# Altium project EE209_Prototype.PrjPcb
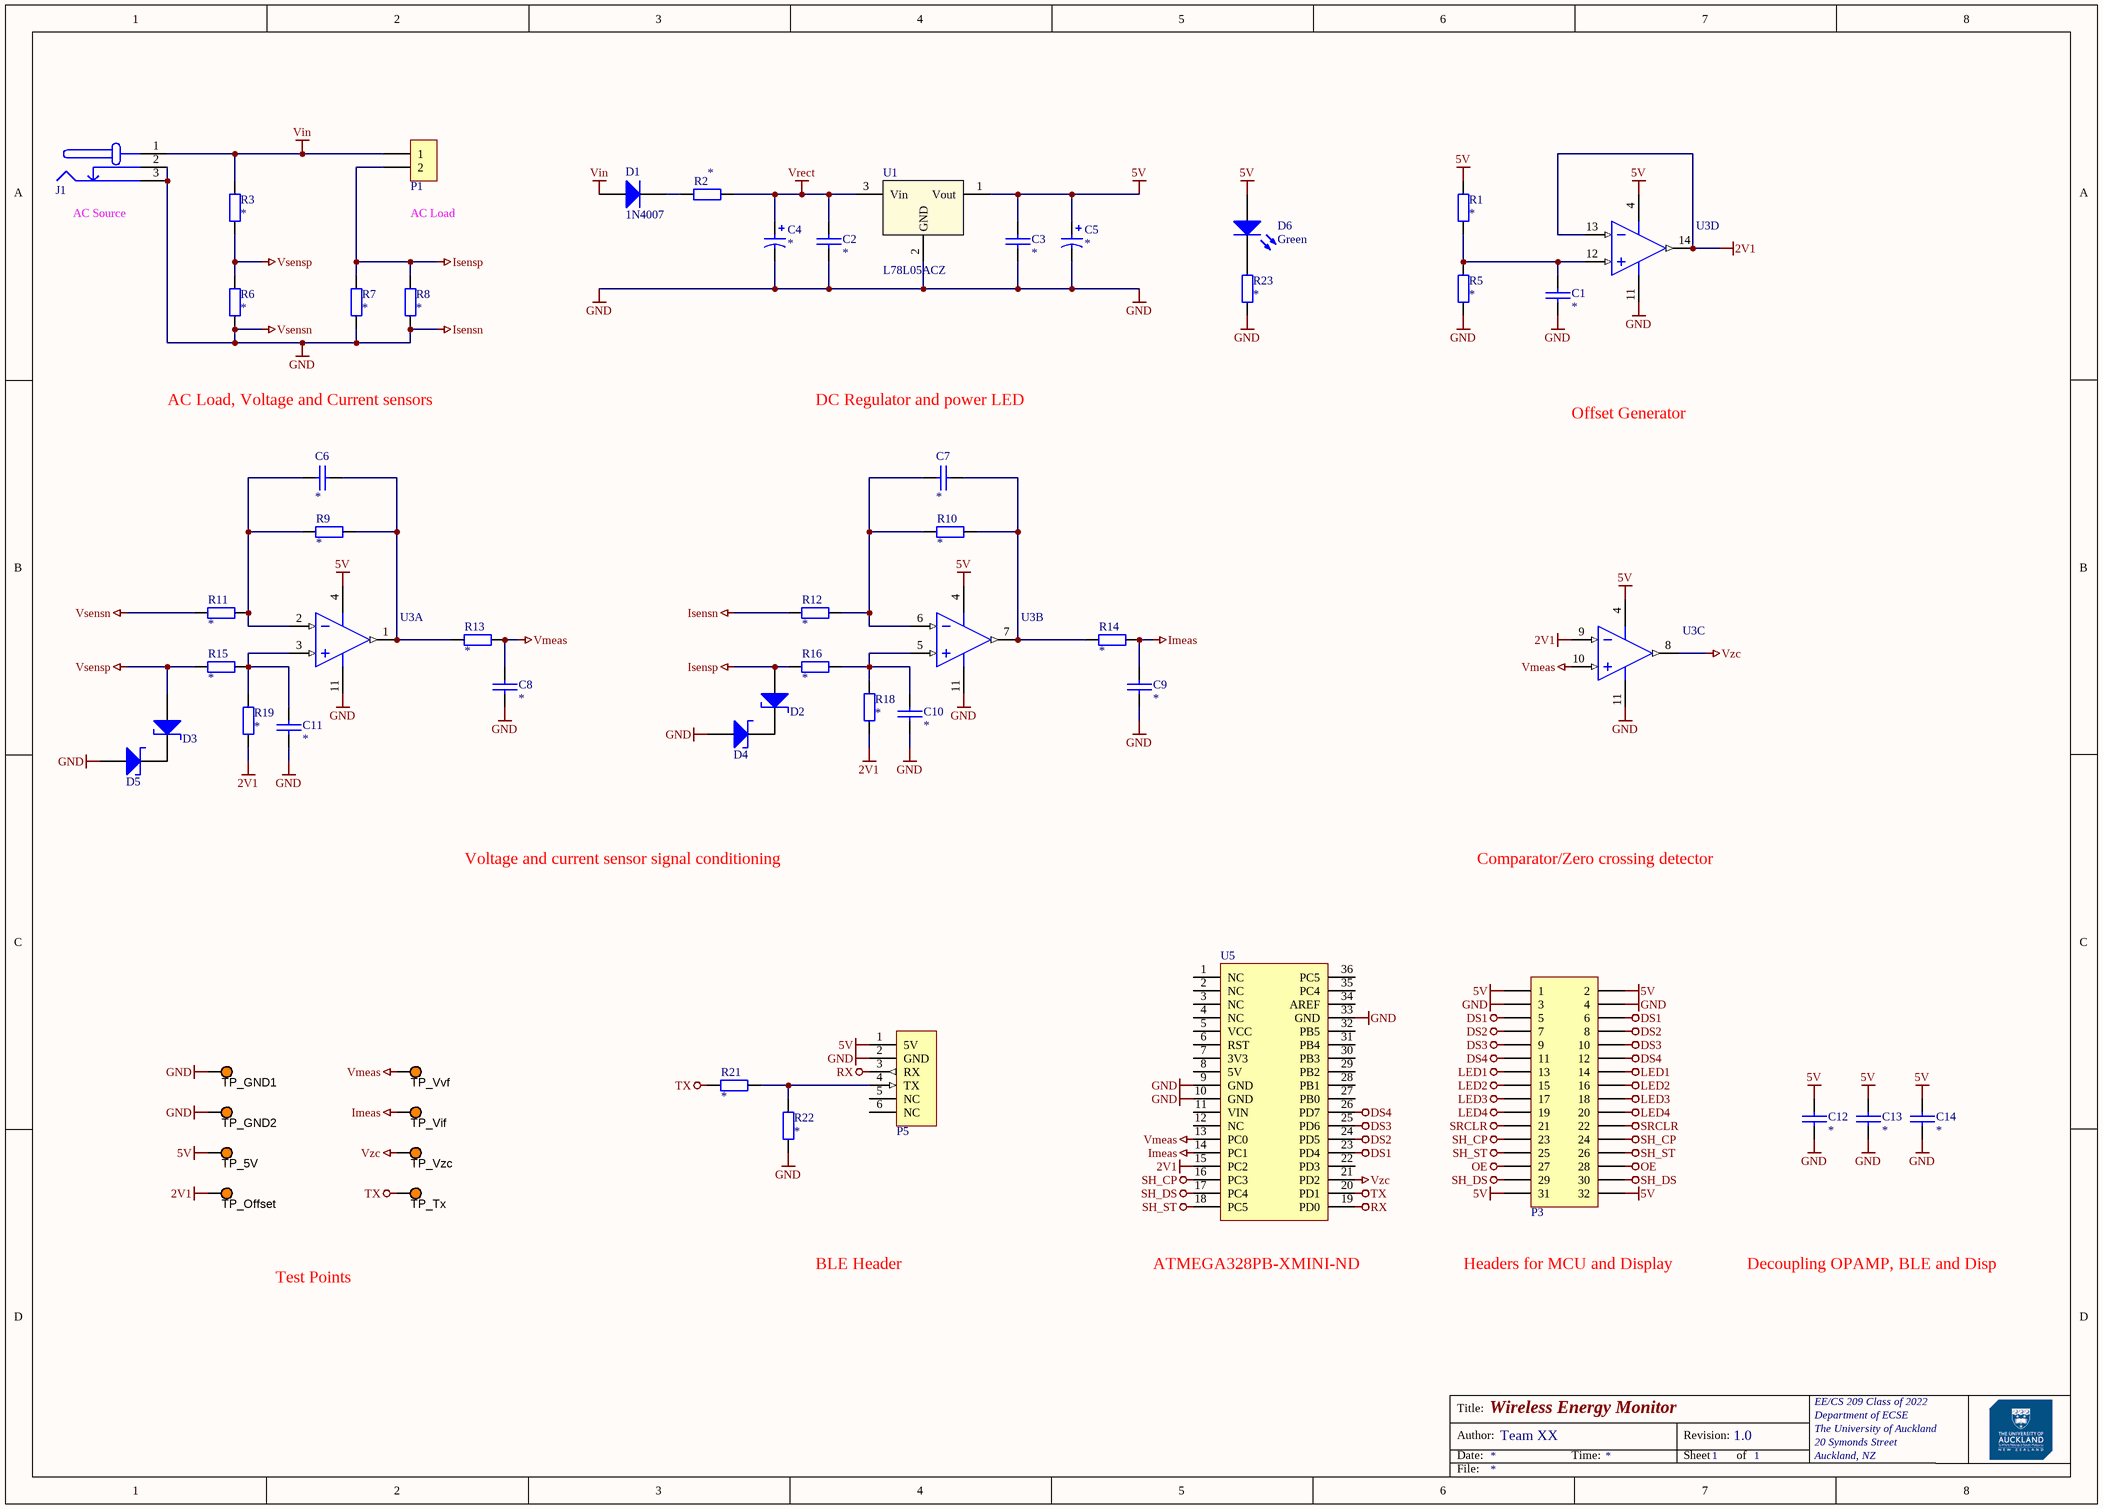
[diagram p0: EE209_Schematic.SchDoc]
1 sheet, 55 parts. Net scope: global (net labels, ports and power ports of the same name join across sheets).
Board file: PCB.PcbDoc

## Sheet EE209_Schematic.SchDoc: Wireless Energy Monitor
size A3; Author: Team XX; Organization: EE/CS 209 Class of 2022; Address1: Department of ECSE; Address2: The University of Auckland; Address3: 20 Symonds Street; Address4: Auckland, NZ; Revision: 1.0; SheetNumber: 1; SheetTotal: 1

### Parts
C1  *  [CCAP-5P0]
C2  *  [CCAP-5P0]
C3  *  [CCAP-5P0]
C4  *  [CAP-RAD-2.5mm Pitch]
C5  *  [CAP-RAD-2.5mm Pitch]
C6  *  [CCAP-5P0]
C7  *  [CCAP-5P0]
C8  *  [CCAP-5P0]
C9  *  [CCAP-5P0]
C10  *  [CCAP-5P0]
C11  *  [CCAP-5P0]
C12  *  [CCAP-5P0]
C13  *  [CCAP-5P0]
C14  *  [CCAP-5P0]
D1  1N4007  [1N4007-MFG]
D2  BZX79-CXVX  [AXIAL-Zener-0.4]  (value not drawn)
D3  BZX79-CXVX  [AXIAL-Zener-0.4]  (value not drawn)
D4  BZX79-CXVX  [AXIAL-Zener-0.4]  (value not drawn)
D5  BZX79-CXVX  [AXIAL-Zener-0.4]  (value not drawn)
D6  Green  [LED]
J1  DC barrel jack  [AC-Socket]  (value not drawn)
P1  Dual Banana Plugs  [Dual Banana Plug]  (value not drawn)
P3  Display  [Display]  (value not drawn)
P5  BLE Module Header  [HM10_HDR1X6]  (value not drawn)
R1  *  [AXIAL-0.4]
R2  *  [AXIAL-0.4]
R3  *  [AXIAL-0.4]
R5  *  [AXIAL-0.4]
R6  *  [AXIAL-0.4]
R7  *  [AXIAL-0.4]
R8  *  [AXIAL-0.4]
R9  *  [AXIAL-0.4]
R10  *  [AXIAL-0.4]
R11  *  [AXIAL-0.4]
R12  *  [AXIAL-0.4]
R13  *  [AXIAL-0.4]
R14  *  [AXIAL-0.4]
R15  *  [AXIAL-0.4]
R16  *  [AXIAL-0.4]
R18  *  [AXIAL-0.4]
R19  *  [AXIAL-0.4]
R21  *  [AXIAL-0.4]
R22  *  [AXIAL-0.4]
R23  *  [AXIAL-0.4]
TP_5V  5003  [TP_TH]  (value not drawn)
TP_GND1  5003  [TP_TH]  (value not drawn)
TP_GND2  5003  [TP_TH]  (value not drawn)
TP_Offset  5003  [TP_TH]  (value not drawn)
TP_Tx  5003  [TP_TH]  (value not drawn)
TP_Vif  5003  [TP_TH]  (value not drawn)
TP_Vvf  5003  [TP_TH]  (value not drawn)
TP_Vzc  5003  [TP_TH]  (value not drawn)
U1  L78L05ACZ  [TO-92]
U3  LM324  [DIP-14]  (value not drawn)  (parts A,B,C,D of 4)
U5  ATmega328PB Xplained Mini Header  [ATmeg328P Xplained]  (value not drawn)

### Nets
2V1: R18.1 R19.1 TP_Offset.1 U3.9(VINC-) U3.13(VIND-) U3.14(VOUTD) U5.15(PC2)
5V: C3.1 C5.1 C12.1 C13.1 C14.1 D6.1(A) P3.1 P3.2 P3.31 P3.32 P5.1(5V) R1.2 TP_5V.1 U1.1(Vout) U3.4(VDD)
DS1: P3.5 P3.6 U5.23(PD4)
DS2: P3.7 P3.8 U5.24(PD5)
DS3: P3.9 P3.10 U5.25(PD6)
DS4: P3.11 P3.12 U5.26(PD7)
GND: C1.2 C2.2 C3.2 C4.2 C5.2 C8.1 C9.2 C10.2 C11.2 C12.2 C13.2 C14.2 D4.1(A) D5.1(A) J1.2(GND_ALT) J1.3(GND) P3.3 P3.4 P5.2(GND) R5.1 R6.1 R7.1 R8.1 R11.1 R12.1 R22.1 R23.1 TP_GND1.1 TP_GND2.1 U1.2(GND) U3.11(VSS) U5.9(GND) U5.10(GND) U5.33(GND)  [also labelled Isensn, Vsensn]
Imeas: C9.1 R14.2 TP_Vif.1 U5.14(PC1)
Isensp: D2.1(A) P1.2 R7.2 R8.2 R16.1
LED1: P3.13 P3.14
LED2: P3.15 P3.16
LED3: P3.17 P3.18
LED4: P3.19 P3.20
OE: P3.27 P3.28
RX: P5.3(RX) U5.19(PD0)
SH_CP: P3.23 P3.24 U5.16(PC3)
SH_DS: P3.29 P3.30 U5.17(PC4)
SH_ST: P3.25 P3.26 U5.18(PC5)
SRCLR: P3.21 P3.22
TX: R21.1 TP_Tx.1 U5.20(PD1)
Vin: D1.1(A) J1.1(VCC) P1.1 R3.2
Vmeas: C8.2 R13.2 TP_Vvf.1 U3.10(VINC+) U5.13(PC0)
Vrect: C2.1 C4.1 R2.2 U1.3(Vin)
Vsensp: D3.1(A) R3.1 R6.2 R15.1
Vzc: TP_Vzc.1 U3.8(VOUTC) U5.21(PD2)
NetC1_1: C1.1 R1.1 R5.2 U3.12(VIND+)
NetC6_1: C6.1 R9.1 R11.2 U3.2(VINA-)
NetC6_2: C6.2 R9.2 R13.1 U3.1(VOUTA)
NetC7_1: C7.1 R10.2 R12.2 U3.6(VINB-)
NetC7_2: C7.2 R10.1 R14.1 U3.7(VOUTB)
NetC10_1: C10.1 R16.2 R18.2 U3.5(VINB+)
NetC11_1: C11.1 R15.2 R19.2 U3.3(VINA+)
NetD1_2: D1.2(K) R2.1
NetD2_2: D2.2(K) D4.2(K)
NetD3_2: D3.2(K) D5.2(K)
NetD6_2: D6.2(K) R23.2
NetP5_4: P5.4(TX) R21.2 R22.2

Not connected (* = marked no-connect by the designer): P5 5(NC) 6(NC); U5 1(NC) 2(NC) 3(NC) 4(NC) 5(VCC) 6(RST) 7(3V3) 8(5V) 11(VIN) 12(NC) 22(PD3) 27(PB0) 28(PB1) 29(PB2) 30(PB3) 31(PB4) 32(PB5) 34(AREF) 35(PC4) 36(PC5)

### Notes on the sheet
- (near J1) AC Source
- (near P1) AC Load
- AC Load, Voltage and Current sensors
- DC Regulator and power LED
- Offset Generator
- Voltage and current sensor signal conditioning
- Comparator/Zero crossing detector
- Test Points
- BLE Header
- (near U5) ATMEGA328PB-XMINI-ND
- Headers for MCU and Display
- Decoupling OPAMP, BLE and Disp
- Title:
- Author:
- Date:
- Time:
- Revision:
- Sheet
- of
- File:

### Library data of the parts
C1-C3 C6-C14 = CerCap_TH_5P0: TH ceramic capacitor with 5mm pitch; Value: *
C4 C5 = ElecCap_TH_2P0: Electrolytic capacitor with radial package, 2mm pitch and 5.2mm diameter; Published: 8-Jun-2000; LatestRevisionDate: 17-Jul-2002; LatestRevisionNote: Re-released for DXP Platform.; PackageReference: POLAR0.8; Publisher: Altium Limited; PackageDescription: Polarized Capacitor; 2 Leads; Value: *
D1 = 1N4007_TH_4AX0: 1N4007 1000V standard axial diode; ComponentLink1URL: https://www.fairchildsemi.com/datasheets/1N/1N914.pdf; ComponentLink1Description: https://www.fairchildsemi.com/datasheets/1N/1N914.pdf; Supplier 1: Digi-Key; Supplier Part Number 1: 1N4007RLGOSCT-ND
D2-D5 = Zener_TH_4AX0: Axial zener diode BZX79 series; Manufacturer: Nexperia USA Inc.; Manufacturer Part Number: BZX79-C4V7,143; Tolerance: ±5%; Supplier 1: Digi-Key; RoHS: RoHS Compliant; Category: Discrete Semiconductor Products; Stock 1: 8933; Pricing 1: 1=0.23, 10=0.206, 100=0.1123, 500=0.06912, 1000=0.04714 (NZD); Packaging: Cut Tape (CT); Part Status: Active; Operating Temperature: -65°C ~ 200°C; Mounting Type: Through Hole; Package / Case: DO-204AH, DO-35, Axial; Supplier Device Package: DO-35; ComponentLink1URL: https://assets.nexperia.com/documents/data-sheet/BZX79.pdf; ComponentLink1Description: https://assets.nexperia.com/documents/data-sheet/BZX79.pdf; Supplier Part Number 1: 1727-1864-1-ND
D6 = LED_TH_2P54: Typical throughole GaAs LED with 2.54mm pitch; Manufacturer: Generic Components; Class I: Optoelectronic; Published: 8-Jun-2000; Revision: July-2002: Re-released for DXP Platform.; Publisher: Altium Limited; Class II: LED; Value: Green
J1 = AC_Input: DC barrel jack connection to AC source; Value: socket
P1 = AC_Output: Dual banana plugs connection to the AC load; LatestRevisionDate: 17-Jul-2002; LatestRevisionNote: Re-released for DXP Platform.; Publisher: Altium Limited
P3 = Display: 16-Pin Header Connecting Display
P5 = BLEModule_TH: 2.54mm pitch 6-pin header for BLE module; LatestRevisionDate: 17-Jul-2002; LatestRevisionNote: Re-released for DXP Platform.; Publisher: Altium Limited
R1-R3 R5-R16 R18 R19 R21-R23 = Res_TH_0AX4: Through hole resistor; Published: 8-Jun-2000; LatestRevisionDate: 17-Jul-2002; LatestRevisionNote: Re-released for DXP Platform.; PackageReference: AXIAL-0.4; Publisher: Altium Limited; Value: *; ComponentLink1Description: http://www.royalohm.com/pdf/product2017/PrecisionMetalMF.pdf
TP_5V TP_GND1 TP_GND2 TP_Offset TP_Tx TP_Vif TP_Vvf TP_Vzc = TestPoint: Test Point, Orange, 1-Pin THD, RoHS; Peak Reverse Current: 600 uA; Forward Current: 3 A; Max Surge Current: 80 A; Forward Voltage: 1.08 V; Max Operating Temperature: 150 degC; PackageReference: 5003; Pins: 2; ComponentLink2URL: http://keyelco.com/userAssets/file/M65p56.pdf; PackageDescription: 1-Pin Through Hole Device, Dia 2.54 mm; Weight: 0.01 lb; Diameter: 5.3 mm; Mount: Through Hole; Package Quantity: 500; Packaging: Bulk; Min Operating Temperature: -65 degC; ComponentLink1Description: Manufacturer URL; Height: 0.25 inch; ComponentLink1URL: http://www.keyelco.com/; ComponentLink2Description: Datasheet; Width: 0.25 inch; REACH SVHC: No SVHC; RoHSCompliant: true; Radiation Hardening: No; Length: 9.5 mm; DatasheetVersion: Jun-15
U1 = L78L05_TH_TO92: Voltage Regulator 5V; Manufacturer: ON Semiconductor; Manufacturer Part Number: LM78L05ACZX; Output Configuration: Positive; Output Type: Fixed; Voltage - Input (Max): 30V; Current - Output: 100mA; PSRR: 80dB (120Hz); Protection Features: Over Temperature, Short Circuit; Supplier 1: Digi-Key; RoHS: RoHS Compliant; Category: Integrated Circuits (ICs); Stock 1: 7782; Pricing 1: 1=0.69, 10=0.517, 100=0.3226, 500=0.2207, 1000=0.16976 (NZD); Packaging: Cut Tape (CT); Part Status: Active; Voltage - Output (Min/Fixed): 5V; Voltage - Output (Max): -; Voltage Dropout (Max): -; Control Features: -; Operating Temperature: -40°C ~ 125°C; Mounting Type: Through Hole; Package / Case: TO-226-3, TO-92-3 (TO-226AA) (Formed Leads); Supplier Device Package: TO-92-3; Base Part Number: LM78L05; ComponentLink1URL: https://www.fairchildsemi.com/datasheets/MC/MC78L05A.pdf; ComponentLink1Description: https://www.fairchildsemi.com/datasheets/MC/MC78L05A.pdf; Supplier Part Number 1: LM78L05ACZXCT-ND
U3 = LM324N_TH_DIP16: IC OPAMP GP 14DIP; Manufacturer: ON Semiconductor; Manufacturer Part Number: LM324N; Amplifier Type: General Purpose; Current - Supply: 1mA; Voltage - Supply, Single/Dual (±): 3 V ~ 32 V, ±1.5 V ~ 16 V; Supplier 1: Digi-Key; RoHS: RoHS Compliant; Category: Integrated Circuits (ICs); Stock 1: 2900; Pricing 1: 1=0.9, 10=0.775, 100=0.5789, 500=0.45482, 1000=0.35145 (NZD); Packaging: Tube; Part Status: Active; Output Type: -; Slew Rate: -; Operating Temperature: 0°C ~ 70°C; Mounting Type: Through Hole; Package / Case: 14-DIP (0.300", 7.62mm); Supplier Device Package: 14-DIP; Base Part Number: LM324; ComponentLink1URL: https://www.fairchildsemi.com/datasheets/LM/LM2902.pdf; ComponentLink1Description: https://www.fairchildsemi.com/datasheets/LM/LM2902.pdf; Supplier Part Number 1: LM324NFS-ND
U5 = ATmega328PBXplained_TH: Dual 18-pin headers connecting to ATmega328PB Xplained Mini; Manufacturer: Microchip Technology; Manufacturer Part Number: ATMEGA328PB-XMINI; Board Type: Evaluation Platform; Core Processor: AVR; Platform: ATmega328P Xplained Mini; Contents: Board(s); Supplier 1: Digi-Key; RoHS: RoHS Compliant; Category: Development Boards, Kits, Programmers; Stock 1: 454; Pricing 1: 1=15.11 (NZD); Part Status: Active; Type: MCU 8-Bit; Operating System: -; For Use With/Related Products: ATmega328P; Mounting Type: Fixed; ComponentLink1URL: http://www.microchip.com/mymicrochip/filehandler.aspx?ddocname=en589665; ComponentLink1Description: http://www.microchip.com/mymicrochip/filehandler.aspx?ddocname=en589665